# Altium schematic sheet FT2232.SchDoc: Connector 300Pins
size A4; SheetNumber: 8; SheetTotal: 29
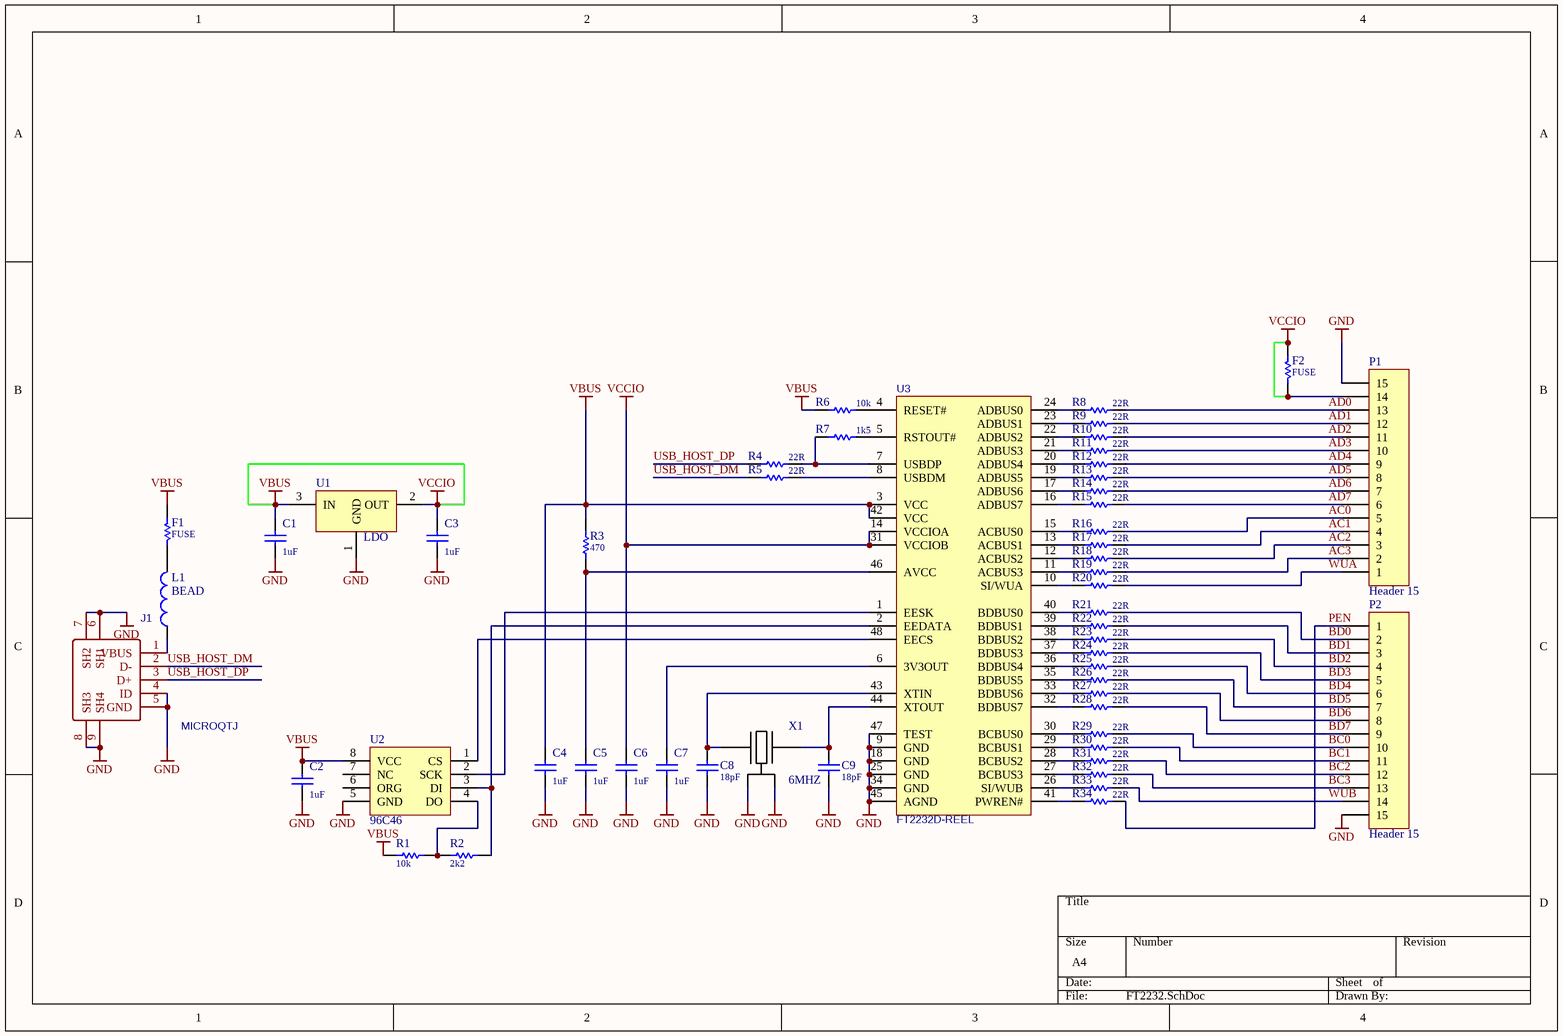
[diagram p0: FT2232.SchDoc]

## Parts
C1  1uF  [C0603]
C2  1uF  [C0603]
C3  1uF  [C0603]
C4  1uF  [C0603]
C5  1uF  [C0603]
C6  1uF  [C0603]
C7  1uF  [C0603]
C8  18pF  [C0402]
C9  18pF  [C0402]
F1  FUSE  [R1206]
F2  FUSE  [R1206]
J1  MICROQTJ  [MICRO-USB-SMD_MICROQTJ]
L1  BEAD  [L0402]
P1  Header 15  [HDR1X15]
P2  Header 15  [HDR1X15]
R1  10k  [R0603]
R2  2k2  [R0603]
R3  470  [R0603]
R4  22R  [R0603]
R5  22R  [R0603]
R6  10k  [R0603]
R7  1k5  [R0603]
R8  22R  [R0603]
R9  22R  [R0603]
R10  22R  [R0603]
R11  22R  [R0603]
R12  22R  [R0603]
R13  22R  [R0603]
R14  22R  [R0603]
R15  22R  [R0603]
R16  22R  [R0603]
R17  22R  [R0603]
R18  22R  [R0603]
R19  22R  [R0603]
R20  22R  [R0603]
R21  22R  [R0603]
R22  22R  [R0603]
R23  22R  [R0603]
R24  22R  [R0603]
R25  22R  [R0603]
R26  22R  [R0603]
R27  22R  [R0603]
R28  22R  [R0603]
R29  22R  [R0603]
R30  22R  [R0603]
R31  22R  [R0603]
R32  22R  [R0603]
R33  22R  [R0603]
R34  22R  [R0603]
U1  LDO  [TO-252AA (DPAK)]
U2  96C46  [MSOP8]
U3  FT2232D-REEL  [LQFP-48_L7.0-W7.0-P0.50-LS9.0-BL]
X1  6MHZ  [CRYSTAL_3.2x2.5mm]

## Nets
GND: C1.1 C2.1 C3.1 C4.1 C5.1 C6.1 C7.1 C8.1 C9.1 J1.4(ID) J1.5(GND) J1.6(SH1) J1.7(SH2) J1.8(SH3) J1.9(SH4) P1.15 P2.15 U1.1(GND) U2.5(GND) U3.9(GND) U3.18(GND) U3.25(GND) U3.34(GND) U3.45(AGND) U3.47(TEST) X1.2(GND) X1.4(GND)
VBUS: C1.2 C2.2 C3.2 C4.2 C6.2 F1.2 F2.1 F2.2 P1.14 R1.2 R3.1 R6.2 U1.2(OUT) U1.3(IN) U2.8(VCC) U3.3(VCC) U3.14(VCCIOA) U3.31(VCCIOB) U3.42(VCC)  [also labelled VCCIO]
AC0: P1.5 R16.1
AC1: P1.4 R17.1
AC2: P1.3 R18.1
AC3: P1.2 R19.1
AD0: P1.13 R8.1
AD1: P1.12 R9.1
AD2: P1.11 R10.1
AD3: P1.10 R11.1
AD4: P1.9 R12.1
AD5: P1.8 R13.1
AD6: P1.7 R14.1
AD7: P1.6 R15.1
BC0: P2.10 R29.1
BC1: P2.11 R30.1
BC2: P2.12 R31.1
BC3: P2.13 R32.1
BD0: P2.2 R21.1
BD1: P2.3 R22.1
BD2: P2.4 R23.1
BD3: P2.5 R24.1
BD4: P2.6 R25.1
BD5: P2.7 R26.1
BD6: P2.8 R27.1
BD7: P2.9 R28.1
PEN: P2.1 R34.1
USB_HOST_DM: J1.2(D-) R5.2
USB_HOST_DP: J1.3(D+) R4.2
WUA: P1.1 R20.1
WUB: P2.14 R33.1
NetC5_2: C5.2 R3.2 U3.46(AVCC)
NetC7_2: C7.2 U3.6(3V3OUT)
NetC8_2: C8.2 U3.43(XTIN) X1.1(X1)
NetC9_2: C9.2 U3.44(XTOUT) X1.3(X2)
NetF1_1: F1.1 L1.1
NetJ1_1: J1.1(VBUS) L1.2
NetR1_1: R1.1 R2.2 U2.4(DO)
NetR2_1: R2.1 U2.3(DI) U3.2(EEDATA)
NetR4_1: R4.1 R7.2 U3.7(USBDP)
NetR5_1: R5.1 U3.8(USBDM)
NetR6_1: R6.1 U3.4(RESET#)
NetR7_1: R7.1 U3.5(RSTOUT#)
NetR8_2: R8.2 U3.24(ADBUS0)
NetR9_2: R9.2 U3.23(ADBUS1)
NetR10_2: R10.2 U3.22(ADBUS2)
NetR11_2: R11.2 U3.21(ADBUS3)
NetR12_2: R12.2 U3.20(ADBUS4)
NetR13_2: R13.2 U3.19(ADBUS5)
NetR14_2: R14.2 U3.17(ADBUS6)
NetR15_2: R15.2 U3.16(ADBUS7)
NetR16_2: R16.2 U3.15(ACBUS0)
NetR17_2: R17.2 U3.13(ACBUS1)
NetR18_2: R18.2 U3.12(ACBUS2)
NetR19_2: R19.2 U3.11(ACBUS3)
NetR20_2: R20.2 U3.10(SI/WUA)
NetR21_2: R21.2 U3.40(BDBUS0)
NetR22_2: R22.2 U3.39(BDBUS1)
NetR23_2: R23.2 U3.38(BDBUS2)
NetR24_2: R24.2 U3.37(BDBUS3)
NetR25_2: R25.2 U3.36(BDBUS4)
NetR26_2: R26.2 U3.35(BDBUS5)
NetR27_2: R27.2 U3.33(BDBUS6)
NetR28_2: R28.2 U3.32(BDBUS7)
NetR29_2: R29.2 U3.30(BCBUS0)
NetR30_2: R30.2 U3.29(BCBUS1)
NetR31_2: R31.2 U3.28(BCBUS2)
NetR32_2: R32.2 U3.27(BCBUS3)
NetR33_2: R33.2 U3.26(SI/WUB)
NetR34_2: R34.2 U3.41(PWREN#)
NetU2_1: U2.1(CS) U3.48(EECS)
NetU2_2: U2.2(SCK) U3.1(EESK)

Not connected (* = marked no-connect by the designer): U2 6(ORG) 7(NC)

## Library data of the parts
C1-C7 = CAP: 1uF 25V X7R 0603; P/N: 0603B105K250NT; LCSC part number: C59302
C8 C9 = CAP: 18pF 50V 0402; P/N: GRM1555C1H180JA01D; LCSC part number: C33149
F1 F2 R2 R3 = RES: P/N: RC0603FR-0710KL
J1 = MICROQTJ: BOM_Manufacturer: SHOU HAN; Contributor: LCSC; BOM_Supplier: LCSC; BOM_Supplier Part: C404968; BOM_Manufacturer Part: MicroQTJ; BOM_JLCPCB Part Class: Extended Part; spicePre: U; spiceSymbolName: MICROQTJ
L1 = BLM18AG601SN1D: INDUCTOR FERRITE BEAD 200mA 1 650mΩ 0402; P/N: CBG100505U600T; LCSC part number: C92615
P1 P2 = Header 15: Header, 15-Pin; LatestRevisionDate: 17-Jul-2002; LatestRevisionNote: Re-released for DXP Platform.; Publisher: Altium Limited
R1 R6 R7 = RES: 10k 0603; P/N: RC0603FR-0710KL
R4 R5 R8-R34 = RES: 22R 5% 0603; P/N: RC0603FR-0722RL
U1 = NCP51460SN33T1G
U2 = Component_2
U3 = FT2232D-REEL: BOM_Manufacturer: FTDI(飞特帝亚); Contributor: LCSC; BOM_Supplier: LCSC; BOM_Supplier Part: C428116; BOM_Manufacturer Part: FT2232D-REEL; BOM_JLCPCB Part Class: Extended Part; spicePre: U; spiceSymbolName: FT2232D-REEL
X1 = CRYSTAL 12MHZ 3.20mm x 2.50mm: CRYSTAL 6MHZ 10PF SMD; P/N: X322512MOB4SI; LCSC part number: C70565